# Altium schematic sheet SIPM_ASSY_CON.SchDoc: MCORD_HUB
size 420 x 297 mm; Author: G.Kasprowicz; CompanyName: WUT ISE; DrawnBy: G.Kasprowicz; Organization: WUT ISE; Address1: PW ISE; Address2: Nowowiejska 15/19 00-665 Warsaw; Address3: gkasprow@gmail.com; DocumentNumber: 2; Revision: 2; SheetNumber: 2; SheetTotal: 6; ModifiedBy: -; CheckedDate: -; Title2: SIPM ASSY connector; DivGrp: WUT ISE; Designer: G.Kasprowicz; ModifiedDate: -; ProjectName: Sensor Box
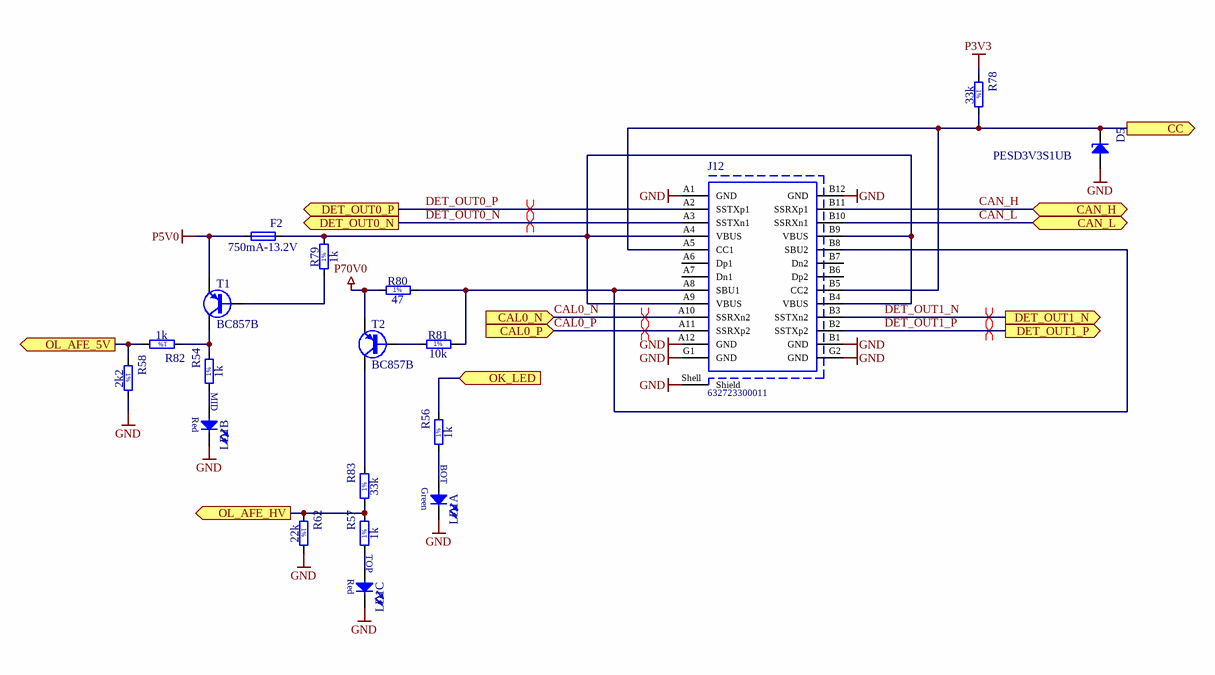
[diagram p0: SIPM_ASSY_CON.SchDoc]

## Parts
D5  PESD3V3S1UB  [SODFL1608X65N]
F2  750mA-13.2V  [FUSRC4632X90N]
J12  632723300011  [632723300011]
LD1  Red/Red/Green  [LED_DIALIGHT_570-0100-112F]  (value not drawn)  (parts A,B,C of 3)
R54  1k  [RESC1005X40N]
R56  1k  [RESC1005X40N]
R57  1k  [RESC1005X40N]
R58  2k2  [RESC1005X40N]
R62  22k  [RESC1005X40N]
R78  33k  [RESC2012X60N]
R79  1k  [RESC1005X40N]
R80  47  [RESC1608X55N]
R81  10k  [RESC2012X60N]
R82  1k  [RESC1005X40N]
R83  33k  [RESC2012X60N]
T1  BC857B  [SOT95P230X110-3N]
T2  BC857B  [SOT95P230X110-3N]

## Ports
CAL0_N (in), CAL0_P (in), CAN_H (bidir), CAN_L (bidir), CC (out), DET_OUT0_N (out), DET_OUT0_P (out), DET_OUT1_N (out), DET_OUT1_P (out), OK_LED (in), OL_AFE_5V (out), OL_AFE_HV (out)

## Nets
GND: D5.2(A) J12.A1(GND) J12.A12(GND) J12.B1(GND) J12.B12(GND) J12.G1(GND) J12.G2(GND) J12.Shell(Shield) LD1.2(C) LD1.4(C) LD1.6(C) R58.2 R62.2
P3V3: R78.1
P5V0: F2.1 T1.2(E)
P70V0: R80.1 T2.2(E)
CAL0_N: J12.A10(SSRXn2) ; port CAL0_N
CAL0_P: J12.A11(SSRXp2) ; port CAL0_P
CAN_H: J12.B11(SSRXp1) ; port CAN_H
CAN_L: J12.B10(SSRXn1) ; port CAN_L
CC: D5.1(C) J12.A5(CC1) J12.B5(CC2) R78.2 ; port CC
DET_OUT0_N: J12.A3(SSTXn1) ; port DET_OUT0_N
DET_OUT0_P: J12.A2(SSTXp1) ; port DET_OUT0_P
DET_OUT1_N: J12.B3(SSTXn2) ; port DET_OUT1_N
DET_OUT1_P: J12.B2(SSTXp2) ; port DET_OUT1_P
OK_LED: R56.2 ; port OK_LED
OL_AFE_5V: R58.1 R82.2 ; port OL_AFE_5V
OL_AFE_HV: R57.2 R62.1 R83.1 ; port OL_AFE_HV
NetF2_2: F2.2 J12.A4(VBUS) J12.A9(VBUS) J12.B4(VBUS) J12.B9(VBUS) R79.2
NetJ12_A8: J12.A8(SBU1) J12.B8(SBU2) R80.2 R81.2
NetLD1_1: LD1.1(A) R56.1
NetLD1_3: LD1.3(A) R54.1
NetLD1_5: LD1.5(A) R57.1
NetR54_2: R54.2 R82.1 T1.3(C)
NetR79_1: R79.1 T1.1(B)
NetR81_1: R81.1 T2.1(B)
NetR83_2: R83.2 T2.3(C)

Not connected (* = marked no-connect by the designer): J12 A6(Dp1) A7(Dn1) B6(Dp2) B7(Dn2)

## Layout directives
differential pair: CAL0_N, CAL0_P, DET_OUT0_N, DET_OUT0_P, DET_OUT1_N, DET_OUT1_P

## Notes on the sheet
- Project/Equipment
- Document
- Designer
- Drawn by
- Check.by
- Copyright WUT ISE 2018.
  This documentation describes Open Hardware and is licensed under the CERN OHL v.1.1. You may redistribute and modify this documentation under the terms of the CERN OHL v.1.1. (http://ohwr.org/CERNOHL). This documentation is distributed WITHOUT ANY EXPRESS OR IMPLIED WARRANTY, INCLUDING OF MERCHANTABILITY, SATISFACTORY QUALITY AND FITNESS FOR A PARTICULAR PURPOSE. Please see the CERN OHL v.1.1 for applicable conditions.
- Contact
- File
- Last Mod.
- Print Date
- Sheet
- Size
- A3
- of
- Rev
- (in symbol LED_DIALIGHT_570-0100-112F, part A) BOT; Green
- (in symbol LED_DIALIGHT_570-0100-112F, part B) MID; Red
- (in symbol LED_DIALIGHT_570-0100-112F, part C) TOP; Red
- (in symbol R0402_1K_1%_0.0625W_100PPM) 1%
- (in symbol R0402_2K2_1%_0.0625W_100PPM) 1%
- (in symbol R0402_22K_1%_0.0625W_100PPM) 1%
- (in symbol R0603_47R_1%_0.1W_100PPM) 1%
- (in symbol R0805_10K_1%_0.125W_100PPM) 1%
- (in symbol R0805_33K_1%_0.125W_100PPM) 1%

## Library data of the parts
D5 = PESD3V3S1UB: ESD protection diode; Part Description: ESD protection diode (23kV); Manufacturer: NXP SEMICONDUCTORS; Voltage: 3V3; Power: 330W; PressFit: No; Bonding: No; Part Number: PESD3V3S1UB; Component Kind: Standard; Component Type: Standard; Device: PESD3V3S1UB; PackageDescription: Ultra Small Outline Diode Flat Lead (SOD-523), Body; 1.2mm L X 0.8mm W X 0.65mm H, IPC Medium Density; Manufacturer Part Number: PESD3V3S1UB; Pin Count: 2; Case: SOD523; Mounted: Yes; Socket: No; SMD: Yes; Sense: No; ComponentHeight: 0.65mm; HelpURL: \\cern.ch\dfs\Applications\Altium\Datasheets\PESD3V3S1UB.pdf; Author: CERN DEM JLC; CreateDate: 29.11.2012; LatestRevisionDate: 29.11.2012
F2 = FUSR1812_LITTELFUSE_MINISMDC075F-2: Fuse; Part Description: PolySwitch® PTC Overcurrent Protection Device; PressFit: No; Part Number: FUSR1812_LITTELFUSE_MINISMDC075F-2; Component Kind: Standard; Component Type: Standard; Pin Count: 2; PackageDescription: Chip Resettable Fuse, 2-Leads, Body 4.6x3.2mm, IPC Medium Density; Family: Fuses Resettable; Mounted: Yes; Socket: No; SMD: Yes; Sense: No; Value: 750mA-13.2V; Manufacturer: LITTELFUSE; Manufacturer Part Number: miniSMDC075F-2; ComponentHeight: 0.38mm; HelpURL: \\cern.ch\dfs\Applications\Altium\Datasheets\FUSR_LITTELFUSE_MINISMDC075F-2.pdf; Author: CERN DEM JLC; CreateDate: 19/06/2017; LatestRevisionDate: 17/08/2017
J12 = 632723300011: USB 3.1 Type C Receptacle WR-COM, Horizontal, SMT / THT; Rated Current: 5 A; Contact Resistance: 30 mOhm; Working Voltage: 20 VDC; ComponentLink1Description: Manufacturer; ComponentLink1URL: http://www.we-online.de; ComponentLink2Description: Datasheet; ComponentLink2URL: https://katalog.we-online.de/em/datasheet/632723x00011%282%29.pdf; Part Number: 632723300011; Published Date: September 2018; Publisher: Wurth Elektronik; Orientation: Horizontal; Connector Type: USB 3.1 Type C; Operating Temperature: -40 to 105 degC; Mounting Technology: SMT / THT; Gender: Receptacle; Packaging: Tape and Reel
LD1 = LED_DIALIGHT_570-0100-112F: LED x3  Top Red, Middle Red, Bottom Green; Part Description: Triple 2mm CBI® LEDs, Red Top, Red Middle, Green Bottom; PressFit: No; Bonding: No; Part Number: LED_DIALIGHT_570-0100-112F; Component Kind: Standard; Component Type: Standard; Color: Red/Red/Green; PackageDescription: 3x 2mm LED (Top: Red , Middle: Red, Bot: Green) PCB Edge Mounting DIALIGHT 570 Serie; Manufacturer: DIALIGHT; Manufacturer Part Number: 570-0100-112F; Pin Count: 6; Mounted: Yes; Socket: No; SMD: No; Sense: No; ComponentHeight: 10.41mm; HelpURL: \\cern.ch\dfs\Applications\Altium\Datasheets\LED_DIALIGHT_570-0100-112F.pdf; Author: CERN DEM JLC; CreateDate: 21.01.2013; LatestRevisionDate: 21.01.2013
R54 R56 R57 R79 R82 = R0402_1K_1%_0.0625W_100PPM: Resistor - 1%; Part Description: General Purpose Thick Film Chip Resistor; Manufacturer: GENERIC; Manufacturer1 Part Number: 232270671002L; TC: ±100ppm/°C; PressFit: No; Part Number: R0402_1K_1%_0.0625W_100PPM; Component Kind: Standard; Component Type: Standard; Pin Count: 2; Value: 1k; Status: Not Recommended; Power: 0.0625W; Tolerance: ±1%; Manufacturer Part Number: R0402_1K_1%_0.0625W_100PPM; Case: 0402; Mounted: Yes; Sense: No; Socket: No; SMD: Yes; Manufacturer1 Example: YAGEO PHYCOMP; Manufacturer1 ComponentHeight: 0.4mm; HelpURL: \\cern.ch\dfs\Applications\Altium\Datasheets\R0402_Phycomp_RC0402.pdf; Author: CERN DEM JLC; CreateDate: 03.12.2007; LatestRevisionDate: 17.10.2012
R58 = R0402_2K2_1%_0.0625W_100PPM: Resistor - 1%; Part Description: General Purpose Thick Film Chip Resistor; Manufacturer: GENERIC; Manufacturer1 Part Number: 232270672202L; TC: ±100ppm/°C; PressFit: No; Part Number: R0402_2K2_1%_0.0625W_100PPM; Component Kind: Standard; Component Type: Standard; Pin Count: 2; Value: 2k2; Status: Not Recommended; Power: 0.0625W; Tolerance: ±1%; Manufacturer Part Number: R0402_2K2_1%_0.0625W_100PPM; Case: 0402; Mounted: Yes; Sense: No; Socket: No; SMD: Yes; Manufacturer1 Example: YAGEO PHYCOMP; Manufacturer1 ComponentHeight: 0.4mm; HelpURL: \\cern.ch\dfs\Applications\Altium\Datasheets\R0402_Phycomp_RC0402.pdf; Author: CERN DEM JLC; CreateDate: 03.12.2007; LatestRevisionDate: 17.10.2012
R62 = R0402_22K_1%_0.0625W_100PPM: Resistor - 1%; Part Description: General Purpose Thick Film Chip Resistor; Manufacturer: GENERIC; Manufacturer1 Part Number: 232270672203L; TC: ±100ppm/°C; PressFit: No; Part Number: R0402_22K_1%_0.0625W_100PPM; Component Kind: Standard; Component Type: Standard; Pin Count: 2; Value: 22k; Status: Not Recommended; Power: 0.0625W; Tolerance: ±1%; Manufacturer Part Number: R0402_22K_1%_0.0625W_100PPM; Case: 0402; Mounted: Yes; Sense: No; Socket: No; SMD: Yes; Manufacturer1 Example: YAGEO PHYCOMP; Manufacturer1 ComponentHeight: 0.4mm; HelpURL: \\cern.ch\dfs\Applications\Altium\Datasheets\R0402_Phycomp_RC0402.pdf; Author: CERN DEM JLC; CreateDate: 03.12.2007; LatestRevisionDate: 17.10.2012
R78 R83 = R0805_33K_1%_0.125W_100PPM: Resistor - 1%; Part Description: General Purpose Thick Film Chip Resistor; Manufacturer: GENERIC; Manufacturer1 Part Number: NRC10F3302TRF; Power: 0.125W; TC: ±100ppm/°C; PressFit: No; Part Number: R0805_33K_1%_0.125W_100PPM; Component Kind: Standard; Component Type: Standard; Pin Count: 2; Value: 33k; Status: Preferred; Tolerance: ±1%; Manufacturer Part Number: R0805_33K_1%_0.125W_100PPM; Case: 0805; Mounted: Yes; Sense: No; Socket: No; SMD: Yes; Manufacturer1 Example: NIC COMPONENT; Manufacturer1 ComponentHeight: 0.6mm; HelpURL: \\cern.ch\dfs\Applications\Altium\Datasheets\R0805_NIC_NRC.pdf; Author: CERN DEM JLC; CreateDate: 03.12.2007; LatestRevisionDate: 13.03.2008
R80 = R0603_47R_1%_0.1W_100PPM: Resistor - 1%; Part Description: General Purpose Thick Film Chip Resistor; Manufacturer: GENERIC; Manufacturer1 Part Number: NRC06F47R0TRF; Power: 0.1W; TC: ±100ppm/°C; PressFit: No; Part Number: R0603_47R_1%_0.1W_100PPM; Component Kind: Standard; Component Type: Standard; Pin Count: 2; Value: 47; Status: Preferred; Tolerance: ±1%; Manufacturer Part Number: R0603_47R_1%_0.1W_100PPM; Case: 0603; Mounted: Yes; Sense: No; Socket: No; SMD: Yes; Manufacturer1 Example: NIC COMPONENT; Manufacturer1 ComponentHeight: 0.55mm; HelpURL: \\cern.ch\dfs\Applications\Altium\Datasheets\R0603_NIC_NRC.pdf; Author: CERN DEM JLC; CreateDate: 03/12/2007; LatestRevisionDate: 13/03/2008
R81 = R0805_10K_1%_0.125W_100PPM: Resistor - 1%; Part Description: General Purpose Thick Film Chip Resistor; Manufacturer: GENERIC; Manufacturer1 Part Number: NRC10F1002TRF; Power: 0.125W; TC: ±100ppm/°C; PressFit: No; Part Number: R0805_10K_1%_0.125W_100PPM; Component Kind: Standard; Component Type: Standard; Pin Count: 2; Value: 10k; Status: Preferred; Tolerance: ±1%; Manufacturer Part Number: R0805_10K_1%_0.125W_100PPM; Case: 0805; Mounted: Yes; Sense: No; Socket: No; SMD: Yes; Manufacturer1 Example: NIC COMPONENT; Manufacturer1 ComponentHeight: 0.6mm; HelpURL: \\cern.ch\dfs\Applications\Altium\Datasheets\R0805_NIC_NRC.pdf; Author: CERN DEM JLC; CreateDate: 03.12.2007; LatestRevisionDate: 13.03.2008
T1 T2 = BC857B: PNP Transistor; Part Description: 45V 100mA PNP general-purpose transistors; Manufacturer: NXP SEMICONDUCTORS; PressFit: No; Bonding: No; Part Number: BC857B; Component Kind: Standard; Component Type: Standard; Device: BC857B; PackageDescription: SOT23, 3 pin, Pitch 0.95mm - 1.3mm W X 2.9mm L X 1.1mm H, IPC Medium Density; Manufacturer Part Number: BC857B; Pin Count: 3; Case: SOT23-3; Mounted: Yes; Socket: No; SMD: Yes; Sense: No; ComponentHeight: 1.1mm; HelpURL: \\cern.ch\dfs\Applications\Altium\Datasheets\BC857B.pdf; Author: CERN DEM JLC; CreateDate: 14.06.2011; LatestRevisionDate: 14.06.2011